# EAGLE design ECG_PROJECT (EAGLE 9.6.2)

## Sheet 1 of 2
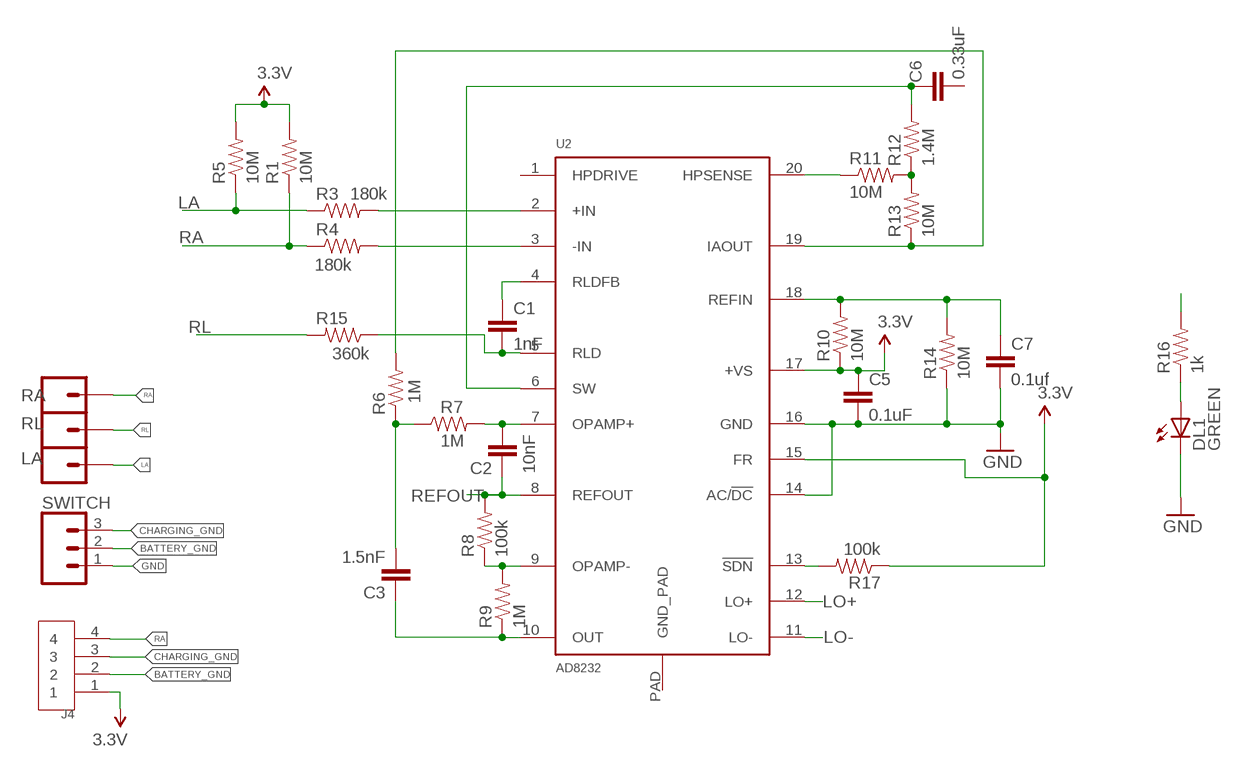
[diagram p0: schematic, sheet 1]

### Parts
C1  1nF  CAP0603-CAP  [0603-CAP]
C2  10nF  CAP0603-CAP  [0603-CAP]
C3  1.5nF  CAP0603-CAP  [0603-CAP]
C5  0.1uF  CAP0603-CAP  [0603-CAP]
C6  0.33uF  CAP0603-CAP  [0603-CAP]
C7  0.1uf  CAP0603-CAP  [0603-CAP]
DL1  GREEN  LED-GREEN-0603  [LEDC1608X80N-AK]
J4  CON-FPC-1MM-04-TE$20$CONNECTIVITY$20$AMP$20$CONNECTORSCON-FPC-1MM-04-TE$20$CONNECTIVITY$20$AMP$20$CONNECTORS_FPC-4PIN  [FPC-4PIN]
LA  CONN_01  [1X01]
R1  10M  RESISTOR0603-RES  [0603-RES]
R3  180k  RESISTOR0603-RES  [0603-RES]
R4  180k  RESISTOR0603-RES  [0603-RES]
R5  10M  RESISTOR0603-RES  [0603-RES]
R6  1M  RESISTOR0603-RES  [0603-RES]
R7  1M  RESISTOR0603-RES  [0603-RES]
R8  100k  RESISTOR0603-RES  [0603-RES]
R9  1M  RESISTOR0603-RES  [0603-RES]
R10  10M  RESISTOR0603-RES  [0603-RES]
R11  10M  RESISTOR0603-RES  [0603-RES]
R12  1.4M  RESISTOR0603-RES  [0603-RES]
R13  10M  RESISTOR0603-RES  [0603-RES]
R14  10M  RESISTOR0603-RES  [0603-RES]
R15  360k  RESISTOR0603-RES  [0603-RES]
R16  1k  1K-1%  [0603-RES]
R17  100k  1K-1%  [0603-RES]
RA  CONN_01  [1X01]
RL  CONN_01  [1X01]
SWITCH  455-1750-1-ND  CONN_03  [1X03]
U2  AD8232  [LFCSP_20]

### Nets
3.3V: C5.1 J4.1 R1.2 R5.2 R10.1 R17.1 U2.15(FR) U2.17(+VS) ; also sheet 2
AIN3_A0: C3.1 R9.1 R16.2 U2.10(OUT) ; also sheet 2
BATTERY_GND: J4.2 SWITCH.2
CHARGING_GND: J4.3 SWITCH.3
GND: C5.2 C7.2 DL1.C R14.1 SWITCH.1 U2.14(AC/!DC) U2.16(GND) ; also sheet 2
LA: LA.1 R3.1 R5.1
LO+: U2.12(LO+) ; also sheet 2
LO-: U2.11(LO-) ; also sheet 2
N$1: R3.2 U2.2(+IN)
N$3: R4.2 U2.3(-IN)
N$4: C2.2 R7.2 U2.7(OPAMP+)
N$5: R11.1 U2.20(HPSENSE)
N$6: C7.1 R10.2 R14.2 U2.18(REFIN)
N$7: R8.1 R9.2 U2.9(OPAMP-)
N$8: R6.2 R13.1 U2.19(IAOUT)
N$9: C3.2 R6.1 R7.1
N$11: R17.2 U2.13(!SDN)
N$12: DL1.A R16.1
N$14: R11.2 R12.1 R13.2
N$16: C6.1 R12.2 U2.6(SW)
N$17: C1.1 U2.4(RLDFB)
N$18: C1.2 R15.1 U2.5(RLD)
RA: J4.4 R1.1 R4.1 RA.1
REFOUT: C2.1 R8.2 U2.8(REFOUT)
RL: R15.2 RL.1
Unconnected: C6.2 U2.1(HPDRIVE) U2.PAD(GND_PAD)

## Sheet 2 of 2
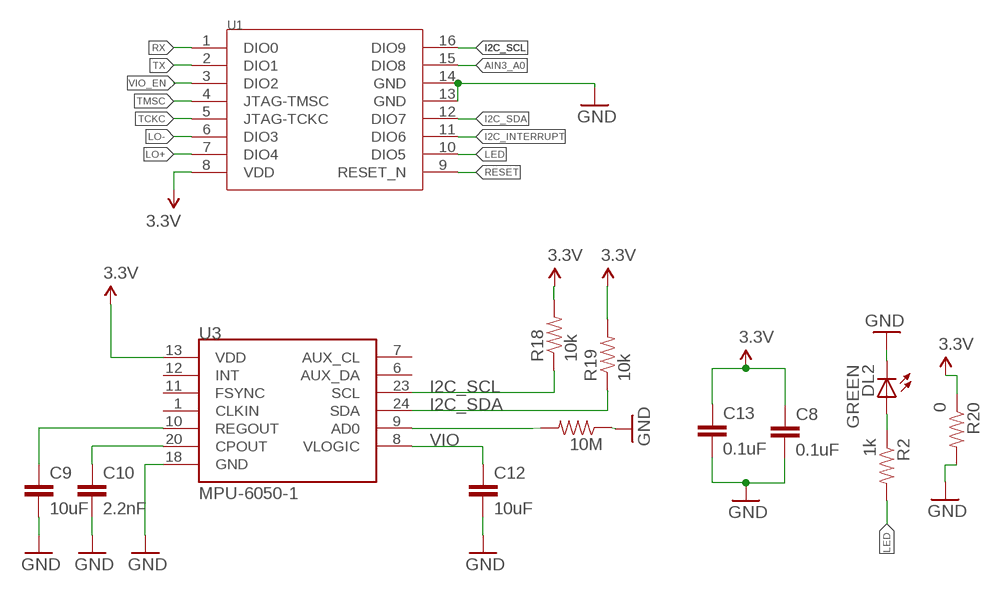
[diagram p1: schematic, sheet 2]

### Parts
10M  1k  1K-1%  [0603-RES]
C8  0.1uF  CAP0603-CAP  [0603-CAP]
C9  10uF  CAP0603-CAP  [0603-CAP]
C10  2.2nF  CAP0603-CAP  [0603-CAP]
C12  10uF  CAP0603-CAP  [0603-CAP]
C13  0.1uF  CAP0603-CAP  [0603-CAP]
DL2  GREEN  LED-GREEN-0603  [LEDC1608X80N-AK]
R2  1k  1K-1%  [0603-RES]
R18  10k  RESISTOR0603-RES  [0603-RES]
R19  10k  RESISTOR0603-RES  [0603-RES]
R20  0  RESISTOR0603-RES  [0603-RES]
U1  IC-MCU-5.1GHZ-CANSECIC-MCU-5.1GHZ-CANSEC_AN2640R2SA-K_MODULE$20$-$20$DUPLICATE  [AN2640R2SA-K_MODULE$20$-$20$DUPLICATE]
U3  MPU-6050-1  [QFN-24-4MM2]

### Nets
3.3V: C8.1 C13.1 R18.2 R19.2 R20.1 U1.8(VDD) U3.13(VDD) ; also sheet 1
AIN3_A0: U1.15(DIO8) ; also sheet 1
GND: 10M.1 C8.2 C9.2 C10.2 C12.2 C13.2 DL2.C R20.2 U1.13(GND) U1.14(GND) U3.18(GND) ; also sheet 1
I2C_INTERRUPT: U1.11(DIO6)
I2C_SCL: R18.1 U1.16(DIO9) U3.23(SCL)
I2C_SDA: R19.1 U1.12(DIO7) U3.24(SDA)
LED: R2.2 U1.10(DIO5)
LO+: U1.7(DIO4) ; also sheet 1
LO-: U1.6(DIO3) ; also sheet 1
N$2: DL2.A R2.1
N$10: C10.1 U3.20(CPOUT)
N$15: C9.1 U3.10(REGOUT)
N$19: 10M.2 U3.9(AD0)
RESET: U1.9(RESET_N)
RX: U1.1(DIO0)
TCKC: U1.5(JTAG-TCKC)
TMSC: U1.4(JTAG-TMSC)
TX: U1.2(DIO1)
VIO: C12.1 U3.8(VLOGIC)
VIO_EN: U1.3(DIO2)
Unconnected: U3.1(CLKIN) U3.6(AUX_DA) U3.7(AUX_CL) U3.11(FSYNC) U3.12(INT)

## Library data of the parts
10M R2 R16 = SparkFun-Resistors:1K-1%: 1k-ohm SMT 1/10W - 1% (0603) RES-07856; PROD_ID: RES-07856
C1-C3 C5-C7 = SparkFun-Passives:CAP: Capacitor Standard 0603 ceramic capacitor, and 0.1" leaded capacitor.
C8-C10 C12 C13 = SparkFun:CAP: Capacitor Standard 0603 ceramic capacitor, and 0.1" leaded capacitor.
DL1 DL2 = Arduino-diodes:LED: LED; CODE-ARDUINO: 2204; DATASHEET: http://media.digikey.com/pdf/Data%20Sheets/Avago%20PDFs/HSMz-Czzz.pdf; DISTRIBUTOR-LINK: http://www.digikey.com/product-detail/en/broadcom-limited/HSMG-C190/516-1425-1-ND/637749; DISTRIBUTOR-PN: 516-1425-1-ND; MANUFACTURER: Avago; MANUFACTURER-PN: HSMG-C190
J4 = MPU_PCB:CON-FPC-1MM-04-TE$20$CONNECTIVITY$20$AMP$20$CONNECTORS: CONN FPC BOTTOM 4POS 1.00MM R/A; COMPONENT_STATUS: In Dev/QA; CREATION_DATE: 29/12/2021; ENGINEER_CREATED: SL; LIB_STANDARD: 1.0; MFG: TE Connectivity AMP Connectors; MFG_PN: 84952-4; NUMBER_OF_POSITIONS: 4; NUMBER_OF_ROWS: 1; PITCH: 1mm; QA_STATUS: Created
LA RA RL = SparkFun-Connectors:CONN_01: Single connection point. Often used as Generic Header-pin footprint for 0.1 inch spaced/style header connections On any of the 0.1 inch spaced packages, you can populate with these: Break Away Headers - Straight <https://www.sparkfun.com/products/116> (PRT-00116) Break Away Male Headers - Right Angle <https://www.sparkfun.com/products/553> (PRT-00553) Female Headers <https://www.sparkfun.com/products/115> (PRT-00115) Break Away Headers - Machine Pin <https://www.sparkfun.com/products/117> (PRT-00117) Break Away Female Headers - Swiss Machine Pin <https://www.sparkfun.com/products/743> (PRT-00743) This device is also useful as a general connection point to wire up your design to another part of your project. Our various solder wires solder well into these plated through hole pads. Hook-Up Wire - Assortment (Stranded, 22 AWG) <https://www.sparkfun.com/products/11375> (PRT-11375) Hook-Up Wire - Assortment (Solid Core, 22 AWG) <https://www.sparkfun.com/products/11367> (PRT-11367) View the entire wire category on our website here <https://www.sparkfun.com/categories/141> Special notes: SMTSO-256-ET is a "flush mount" nut for a 4-40 screw. We mostly use this on specialty testbeds; it is a nice way to connect hardware to your PCB at an adjustable hieght. Also note, the SNAP packages are for using a snappable style connector. We sell a baggie of snaps and they are also used on two LilyPad designs: Snap Assortment - 30 pack (male and female) <https://www.sparkfun.com/products/11347> (DEV-11347) LilyPad Arduino SimpleSnap <https://www.sparkfun.com/products/10941> (DEV-10941) LilyPad SimpleSnap Protoboard <https://www.sparkfun.com/products/10940> (DEV-10940)
R1 R3-R15 = SparkFun-Passives:RESISTOR: Resistor Basic schematic elements and footprints for 0603, 1206, and PTH resistors.
R17 = SparkFun-Resistors:1K-1%: 1k-ohm SMT 1/10W - 1% (0603) RES-07856; PROD_ID: RES-07856; VALUE: 1k
R18-R20 = SparkFun:RESISTOR: Resistor Basic schematic elements and footprints for 0603, 1206, and PTH resistors.
SWITCH = SparkFun-Connectors:CONN_03: Multi connection point. Often used as Generic Header-pin footprint for 0.1 inch spaced/style header connections On any of the 0.1 inch spaced packages, you can populate with these: Break Away Headers - Straight <https://www.sparkfun.com/products/116> (PRT-00116) Break Away Male Headers - Right Angle <https://www.sparkfun.com/products/553> (PRT-00553) Female Headers <https://www.sparkfun.com/products/115> (PRT-00115) Break Away Headers - Machine Pin <https://www.sparkfun.com/products/117> (PRT-00117) Break Away Female Headers - Swiss Machine Pin <https://www.sparkfun.com/products/743> (PRT-00743) Stackable Header - 3 Pin (Female, 0.1") <https://www.sparkfun.com/products/13875> (PRT-13875) For SCREWTERMINALS and SPRING TERMINALS visit here: Screw Terimnals on SparkFun.com <https://www.sparkfun.com/search/results?term=Screw+Terminals> (5mm/3.5mm/2.54mm spacing) This device is also useful as a general connection point to wire up your design to another part of your project. Our various solder wires solder well into these plated through hole pads. Hook-Up Wire - Assortment (Stranded, 22 AWG) <https://www.sparkfun.com/products/11375> (PRT-11375) Hook-Up Wire - Assortment (Solid Core, 22 AWG) <https://www.sparkfun.com/products/11367> (PRT-11367) View the entire wire category on our website here <https://www.sparkfun.com/categories/141> Special notes: Molex polarized connector foot print use with SKU : PRT-08232 with associated crimp pins and housings.; PROD_ID: XXX-00000
U1 = MPU_PCB:IC-MCU-5.1GHZ-CANSEC: BLUETOOTH MCU256KBROM-5.1GHZ; COMPONENT_STATUS: Active; CREATION_DATE: 23/12/2020; ENGINEER_CREATED: SL; LIB_STANDARD: 1.0; MFG: CANSEC; MFG_PN: AN2640R2SA-K; MFG_SERIES: Enpirion?; OWNER: OoB Services; QA_STATUS: Created
U2 = AD8232:AD8232
U3 = Testing:MPU-6050

## Board
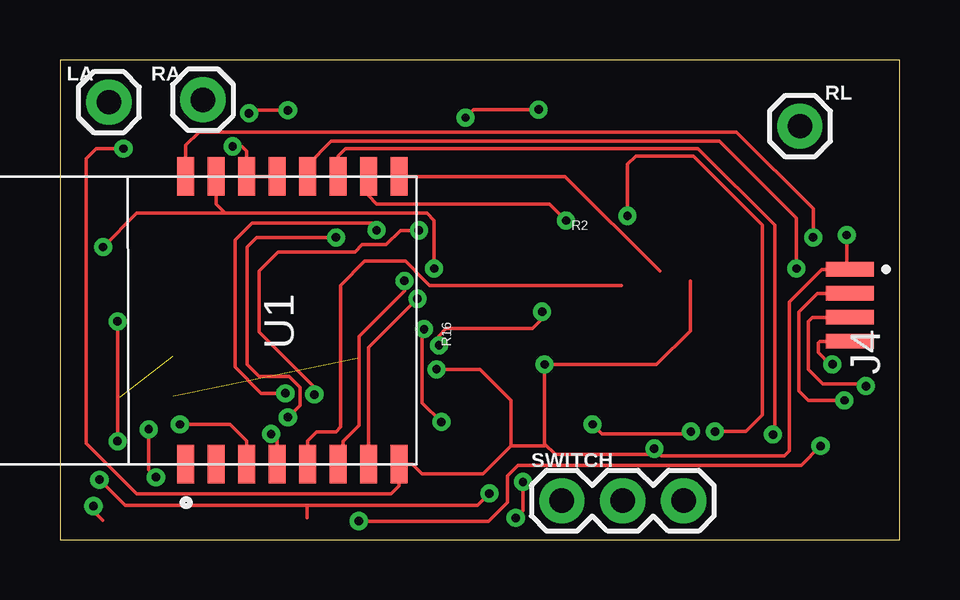
[diagram p2: board, top side]
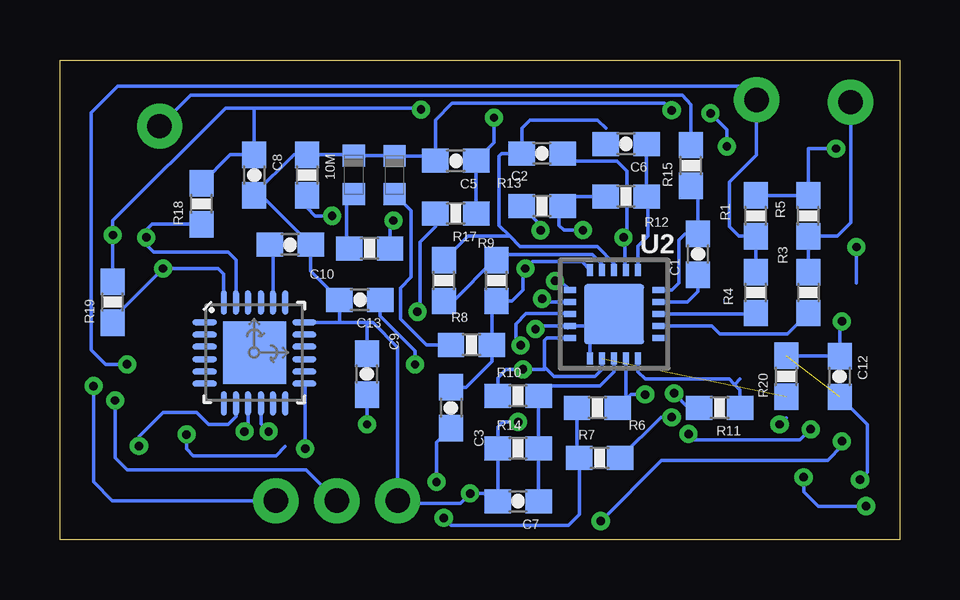
[diagram p3: board, bottom side, seen from below]

Size 35 x 20 mm. Coordinates in mm from the lower left corner, seen from the top.
Outline: 0,0 35,0 35,6.9 35,12.7 35,20 0,20 0,0
Copper layers (1*16): Top 0.035mm / dielectric 1.5mm / Bottom 0.035mm
Design rules "default": minimum track width 6mil, minimum drill 0.35mm, track to track 6mil, track to pad 6mil, pad to pad 6mil, via to via 6mil, smd to smd 6mil, copper to edge 40mil, drill to drill 6mil, minimum pad ring 10mil, minimum via ring 8mil, stop-mask expansion 4mil, vias tented up to drill 0mil, thermal gap 10mil

### Footprints (pad centres in the part's own frame; a part is rotated, then mirrored left to right if it is on the bottom)
0603-RES = smd 1.1 x 1: 1 -0.85,0; 2 0.85,0
0603-CAP = smd 1.1 x 1: 1 -0.85,0; 2 0.85,0
LEDC1608X80N-AK = smd 0.9 x 0.95: A 0.8,0; C -0.8,0
FPC-4PIN = smd 0.61 x 2: 1 -2.5,0; 2 -1.5,0; 3 -0.5,0; 4 0.5,0
1X01 = drill 1.016 pad 1.88: 1 0,0
1X03 = drill 1.016 pad 1.88: 1 0,0; 2 2.54,0; 3 5.08,0
AN2640R2SA-K_MODULE$20$-$20$DUPLICATE = smd 1.6 x 0.7: 1 0,9.615; 2 0,8.345; 3 0,7.075; 4 0,5.805; 5 0,4.535; 6 0,3.265; 7 0,1.995; 8 0,0.725; 9 12,0.725; 10 12,1.995; 11 12,3.265; 12 12,4.535; 13 12,5.805; 14 12,7.075; 15 12,8.345; 16 12,9.615
LFCSP_20 = smd 0.5 x 0.25: 1 -1.85,1; 2 -1.85,0.5; 3 -1.85,0; 4 -1.85,-0.5; 5 -1.85,-1; 11 1.85,-1; 12 1.85,-0.5; 13 1.85,0; 14 1.85,0.5; 15 1.85,1 | smd 0.25 x 0.5: 6 -1,-1.85; 7 -0.5,-1.85; 8 0,-1.85; 9 0.5,-1.85; 10 1,-1.85; 16 1,1.85; 17 0.5,1.85; 18 0,1.85; 19 -0.5,1.85; 20 -1,1.85 | smd 2.5 x 2.5: PAD 0,0
QFN-24-4MM2 = smd 1.016 x 0.254: 1 -2.066,1.257; 2 -2.066,0.75; 3 -2.066,0.247; 4 -2.066,-0.287; 5 -2.066,-0.792; 6 -2.066,-1.297; 13 2.086,-1.297; 14 2.086,-0.792; 15 2.086,-0.287; 16 2.086,0.247; 17 2.086,0.75; 18 2.086,1.257 | smd 0.254 x 1.016: 7 -1.267,-2.122; 8 -0.762,-2.122; 9 -0.258,-2.122; 10 0.278,-2.122; 11 0.78,-2.122; 12 1.287,-2.122; 19 1.287,2.082; 20 0.78,2.082; 21 0.278,2.082; 22 -0.258,2.082; 23 -0.762,2.082; 24 -1.267,2.082 | smd 2.616 x 2.616: P$1 0.02,-0.01

### Placement (x,y rotation side)
10M  24.7,15.2 270 bottom
C1  8.4,11.9 90 bottom
C2  14.9,16.1 0 bottom
C3  18.7,5.5 270 bottom
C5  18.5,15.8 180 bottom
C6  11.4,16.5 180 bottom
C7  15.9,1.6 180 bottom
C8  26.9,15.2 270 bottom
C9  22.2,6.9 90 bottom
C10  25.4,12.3 0 bottom
C12  2.5,6.8 270 bottom
C13  22.5,10 180 bottom
DL1  21.05,15.2 270 bottom
DL2  22.75,15.21 270 bottom
J4  32.93,8.77 270 top
LA  2.04,18.24 0 top
R1  6,13.5 90 bottom
R2  22.09,12.14 0 bottom
R3  3.8,10.3 270 bottom
R4  6,10.3 270 bottom
R5  3.8,13.5 90 bottom
R6  12.6,5.5 0 bottom
R7  12.5,3.4 0 bottom
R8  19,10.8 90 bottom
R9  16.8,10.8 90 bottom
R10  15.9,6 0 bottom
R11  7.5,5.5 180 bottom
R12  11.4,14.3 0 bottom
R13  14.9,13.9 0 bottom
R14  15.9,3.8 0 bottom
R15  8.7,15.6 90 bottom
R16  17.85,8.12 0 bottom
R17  18.5,13.6 180 bottom
R18  29.1,14 90 bottom
R19  32.8,9.9 90 bottom
R20  4.72,6.81 90 bottom
RA  5.96,18.34 0 top
RL  30.85,17.24 0 top
SWITCH  20.92,1.62 0 top
U1  14.86,3.14 90 top
U2  11.9,9.4 180 bottom
U3  26.9,7.8 0 bottom

### Tracks (layer width: path | path; a pad name or v marks a point on that pad's centre or on a via)
3.3V  (via drill 0.35)  (1 unrouted)
  Top 0.152: v15.7,7.1 17.5,7.1 18.8,5.8 18.8,3.9 | v32.8,12.7 32.8,11.4 J4.1 31.77,11.27 30.4,9.9 30.4,3.7 30.2,3.5 25.07,3.5 v24.77,3.79 24.77,3.69 24.62,3.54 20.66,3.54 20.2,4 | 18.8,3.9 20.2,3.9 20.2,4 | v2.65,16.3 1.5,16.3 1.09,15.89 1.09,4.01 3.2,1.9 13.8,1.9 14.14,2.23 U1.8 14.7,3.14 15.1,2.74 17.64,2.74 18.8,3.9 | 20.2,4 v20.2,7.3 24.87,7.3 26.28,8.71 26.28,10.78 | v16.91,17.59 17.25,17.93 v19.95,17.93
  Bottom 0.152: R1.2 R5.2 3.8,16.3 v2.65,16.3 2.6,16.3 | U2.17 12.4,7.1 12.7,6.8 14.41,6.8 14.8,7.2 | 14.8,7.2 14.8,7.1 v15.7,7.1 16.4,7.1 16.75,6.75 R10.1 | 14.8,7.2 14.8,8.3 14.7,8.4 U2.15 | R17.1 C5.1 16.91,16.54 v16.91,17.59 | 26.9,18 28.1,18 32.8,13.3 v32.8,12.7 R19.2 | 26.9,18 C8.1 27.9,16.05 R18.2 | C13.1 21.65,9.32 20.2,7.87 v20.2,7.3 | v24.77,3.79 24.77,6.46 U3.13 | 26.9,18 20.02,18 v19.95,17.93
AIN3_A0  (via drill 0.35)
  Top 0.152: U1.15 6.52,13.98 6.89,13.61 | 6.89,13.61 15.3,13.61 15.6,13.3 v15.6,11.3 | v1.8,12.2 3.21,13.61 6.89,13.61
  Bottom 0.152: U2.10 13.24,11.59 15.31,11.59 v15.6,11.3 15.7,11.3 15.7,10.4 16.15,9.95 R9.1 17,9.75 R16.2 17,7.42 18.07,6.35 C3.1 | v1.8,12.2 1.8,10.7
BATTERY_GND  (via drill 0.35)
  Top 0.152: v32.7,5.8 31.2,5.8 30.8,6.2 30.8,9.5 31.57,10.27 J4.2
  Bottom 0.152: SWITCH.2 24.74,2.9 32.2,2.9 32.7,3.4 v32.7,5.8
CHARGING_GND  (via drill 0.35)
  Top 0.152: J4.3 31.37,9.27 31.2,9.1 31.2,7.1 31.8,6.5 33.5,6.5 v33.6,6.4
  Bottom 0.152: SWITCH.3 32.82,1.62 33.6,2.4 v33.6,6.4
GND  (via drill 0.35)  (1 unrouted)
  Top 0.152: v17.9,1.92 17.4,1.42 10.3,1.42 | 10.3,1.42 2.72,1.42 v1.65,2.49 | U1.13 U1.14 7.79,16.21 7.6,16.39 v7.2,16.39 | v7.88,17.78 8,17.9 v9.5,17.9 | v15.18,8.78 15.09,8.69 15.09,5.71 v15.9,4.9 | 10.3,1.42 10.3,0.9
  Bottom 0.152: 13.82,8.83 U2.14 | C5.2 19.4,15.85 | C5.2 19.55,16 DL1.C DL2.C 22.79,16.05 10M.1 25.25,16.05 26.9,14.4 C8.2 26.6,14.35 C10.2 24.55,11.2 C13.2 23.35,9.11 23.3,9.06 | 22.2,9.06 21.96,9.06 20.92,8.02 SWITCH.1 20.82,1.52 18.3,1.52 v17.9,1.92 17.07,1.92 C7.2 R14.1 16.75,4.7 16.55,4.9 v15.9,4.9 | 22.2,9.06 23.3,9.06 | 23.3,9.06 U3.18 | v1.65,2.49 1.35,2.79 1.35,4.8 C12.2 | C9.2 22.2,9.06 | U2.14 12.8,8.9 | 12.8,8.9 12.4,8.9 | v9.5,17.9 9.8,18.2 18.65,18.2 19.35,17.5 C5.2 | v7.2,16.39 7.2,17.1 v7.88,17.78 | U2.16 12.9,8.8 12.8,8.9 | U2.14 15.06,8.9 v15.18,8.78
I2C_INTERRUPT  (via drill 0.35)
  Top 0.152: U1.11 11.6,16 11.9,16.3 26.6,16.3 29.8,13.11 29.8,4.45 v29.72,4.38
  Bottom 0.152: v29.72,4.38 29.72,3.78 29.44,3.5 26,3.5 25.61,3.89
I2C_SCL  (via drill 0.35)
  Top 0.152: v31.4,12.6 31.4,13.8 28.2,17 5.8,17 5.24,16.45 U1.16
  Bottom 0.152: U3.23 27.66,11.66 28,12 31.1,12 31.4,12.3 v31.4,12.6 31.4,12.9 31.15,13.15 R18.1
I2C_SDA  (via drill 0.35)
  Top 0.152: U1.12 10.32,15.62 11.3,16.61 27.49,16.61 30.7,13.4 v30.7,11.3
  Bottom 0.152: U3.24 28.17,11.07 28.4,11.3 v30.7,11.3 32.8,9.2 R19.1
LA
  Bottom 0.152: R3.1 R5.1 2.6,12.65 2.04,13.21 LA.1
LED  (via drill 0.35)
  Top 0.152: v21.1,13.3 20.4,14 13.2,14 12.86,14.34 U1.10
  Bottom 0.152: R2.2 21.24,13.16 v21.1,13.3
LO+  (via drill 0.35)
  Top 0.152: U1.7 12.86,8.01 v14.9,10.04
  Bottom 0.152: v14.9,10.04 14.76,9.9 U2.12
LO-  (via drill 0.35)
  Top 0.152: U1.6 11.8,3.35 11.8,4.1 12.46,4.76 12.46,8.46 14.36,10.36 v14.36,10.79
  Bottom 0.152: U2.11 14.14,10.79 v14.36,10.79
N$1
  Bottom 0.152: U2.2 7.82,8.9 7.49,8.57 4.68,8.57 R3.2
N$2
  Bottom 0.152: DL2.A 23.05,14.11 23.05,12.25 R2.1
N$3
  Bottom 0.152: R4.2 6.05,9.4 U2.3
N$4  (via drill 0.35)
  Top 0.152: v9.5,5.1 10,5.6 10,6.35 9.55,6.8 8.3,6.8 7.8,7.3 7.8,12.2 8.2,12.6 v11.51,12.6
  Bottom 0.152: R7.2 9.95,5.1 v9.5,5.1 | U2.7 11.45,11.3 11.45,12.6 11.5,12.65 v11.5,12.61 v11.51,12.6 11.37,12.73 11.37,15.37 11.77,15.77 13.8,15.77 14.05,16.03 C2.2
N$5
  Bottom 0.152: 6.65,6.7 6.85,6.5 6.9,6.5 | U2.20 10.9,7 10.6,6.7 7.1,6.7 6.9,6.5 | R11.1 6.65,6.25 6.9,6.5
N$6
  Bottom 0.152: C7.1 R14.2 R10.2 15.05,6.05 14.7,6.4 12.5,6.4 11.9,7 U2.18
N$7
  Bottom 0.152: U2.9 12.4,11.49 12.8,11.89 16.45,11.89 16.7,11.65 R9.2 16.9,11.65 18.6,9.95 R8.1
N$8  (via drill 0.35)
  Top 0.152: v10.61,6.05 10.61,6.35 8.31,8.65 8.31,11.21 9.1,12 11.25,12 11.25,11.99 11.76,11.99 11.77,12 12.3,12 12.6,12.3 12.94,12.3 12.95,12.29 13.45,12.29 13.46,12.3 13.6,12.3 14.19,12.89 v14.96,12.89
  Bottom 0.152: 11.45,7.5 U2.19 11.4,5.85 R6.2 11.2,6.05 v10.61,6.05 | R13.1 14.96,13.12 v14.96,12.89
N$9  (via drill 0.35)
  Top 0.152: v19.3,2.4 19.3,1.2 v19,0.9
  Bottom 0.152: R6.1 13.45,3.5 R7.1 13.35,1.05 13.8,0.6 18.7,0.6 v19,0.9 | v19.3,2.4 19.3,4.05 C3.2
N$10
  Bottom 0.152: U3.20 26.12,12.17 C10.1
N$11  (via drill 0.35)
  Top 0.152: v15.8,8.1 15.8,8.5 16.1,8.8 19.7,8.8 20.1,9.2 v20.1,9.5
  Bottom 0.152: R17.2 19.35,13.05 20,12.4 20,9.6 v20.1,9.5 | U2.13 13.79,9.44 15.56,9.44 16,9 16,8.3 v15.8,8.1
N$12
  Bottom 0.152: R16.1 19.72,8.12 20.8,9.2 20.8,10.5 20.36,10.94 20.36,13.71 DL1.A
N$14  (via drill 0.35)
  Top 0.152: v9.39,6.1 8.39,6.1 7.29,7.2 7.29,12.49 8,13.2 13,13.2 13.2,13 v13.2,12.9
  Bottom 0.152: R12.1 14.3,14.3 14.3,13.9 14.2,13.9 | 14.2,13.9 R13.2 | R11.2 8.79,5.5 v9.39,6.1 | v13.2,12.9 14,12.9 14.2,13.1 14.2,13.9
N$15  (via drill 0.35)
  Top 0.152: v22.2,4.8 22.6,4.4 26.19,4.4 v26.3,4.51
  Bottom 0.152: C9.1 v22.2,4.8 | v26.3,4.51 26.62,4.83 U3.10
N$16
  Bottom 0.152: C6.1 R12.2 10.5,14.25 10.5,12.65 10.9,12.25 U2.6
N$17
  Bottom 0.152: C1.1 8.4,10.35 8.85,9.9 U2.4
N$18
  Bottom 0.152: R15.1 8.4,14.45 C1.2 8.95,12.75 9.2,12.5 9.2,10.7 9.5,10.4 U2.5
N$19  (via drill 0.35)
  Top 0.152: v27.31,4.51 28.59,4.51 29.28,5.2 29.28,13.12 26.41,15.99 24,15.99 23.66,15.65 v23.66,13.5
  Bottom 0.152: U3.9 27.16,4.66 v27.31,4.51 | v23.66,13.5 24.36,13.5 24.7,13.84 10M.2
RA  (via drill 0.35)
  Top 0.152: v32.2,7.31 32.1,7.31 31.6,7.8 31.6,8.2 31.67,8.27 J4.4
  Bottom 0.152: R4.1 R1.1 6.7,12.65 7.1,13.05 7.1,14.9 5.96,16.04 RA.1 6.53,18.91 32.59,18.91 33.7,17.8 33.7,7.91 33.1,7.31 v32.2,7.31
REFOUT
  Bottom 0.152: 12.25,17.15 12.6,17.5 15.4,17.5 15.75,17.15 C2.1 16.6,16.1 16.7,16 16.7,13.1 16.25,12.65 | U2.8 11.9,11.52 12.6,12.22 15.82,12.22 16.25,12.65 | R8.2 18,12.65 16.25,12.65
RESET
  Top 0.152: U1.9 21.06,15.14 25,11.2
RL
  Bottom 0.152: R15.2 8.7,18.14 9.05,18.54 29.55,18.54 RL.1
TCKC
  Top 0.152: U1.5 10.32,4.12 10.7,4.5 11.5,4.5 11.7,4.7 11.7,10.6 12.7,11.61 14.4,11.61 15.2,10.8 15.4,10.6 23.4,10.6
TMSC  (via drill 0.35)
  Top 0.152: U1.4 9.05,4.14 v8.8,4.4 | v3.7,4.6 3.7,2.9 v4,2.6 | 1.79,0.8 1.39,1.19 v1.39,1.39
  Bottom 0.152: v8.8,4.4 8.55,4.15 4.15,4.15 v3.7,4.6 | v4,2.6 4,2 3.39,1.39 v1.39,1.39
VIO  (via drill 0.35)
  Top 0.152: v31.71,3.9 30.91,3.1 19.1,3.1 18.65,2.65 18.65,1.55 17.87,0.77 v12.46,0.77 | v2.4,9.1 v2.4,4.1
  Bottom 0.152: 4.71,7.65 C12.1 2.5,9 v2.4,9.1 | U3.8 27.66,5.14 28,4.8 28.8,4.8 29.3,5.3 30.7,5.3 31.71,4.29 v31.71,3.9 | v2.4,4.1 2.4,3.9 3,3.3 9.93,3.3 v12.46,0.77
VIO_EN  (via drill 0.35)
  Top 0.152: v5,4.8 7.1,4.8 7.79,4.12 U1.3
  Bottom 0.152: 4.72,5.08 v5,4.8